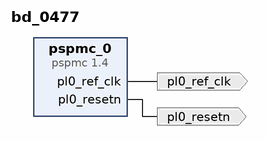
[diagram p0: block diagram of the top level]
# Vivado block design bd_0477, xcvp1202-vsva2785-2MP-e-S, Vivado 2024.2
create_bd_design bd_0477

create_bd_port -dir O -type clk pl0_ref_clk
set_property -dict {CONFIG.FREQ_HZ 333329987} [get_bd_ports pl0_ref_clk]
create_bd_port -dir O -type rst pl0_resetn

create_bd_cell -type ip -vlnv xilinx.com:ip:pspmc:1.4 pspmc_0
